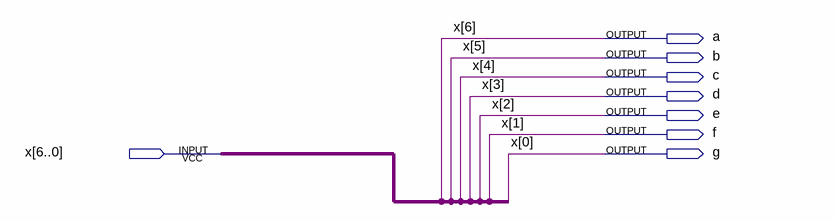
[diagram p0: schematic sheet]
// Quartus schematic separador.bdf as structural Verilog: 0 symbols, 8 pins
module separador (
  input  [6:0] x,
  output a,
  output b,
  output c,
  output d,
  output e,
  output f,
  output g
);


  assign a = x[6];
  assign b = x[5];
  assign c = x[4];
  assign d = x[3];
  assign e = x[2];
  assign f = x[1];
  assign g = x[0];
endmodule
